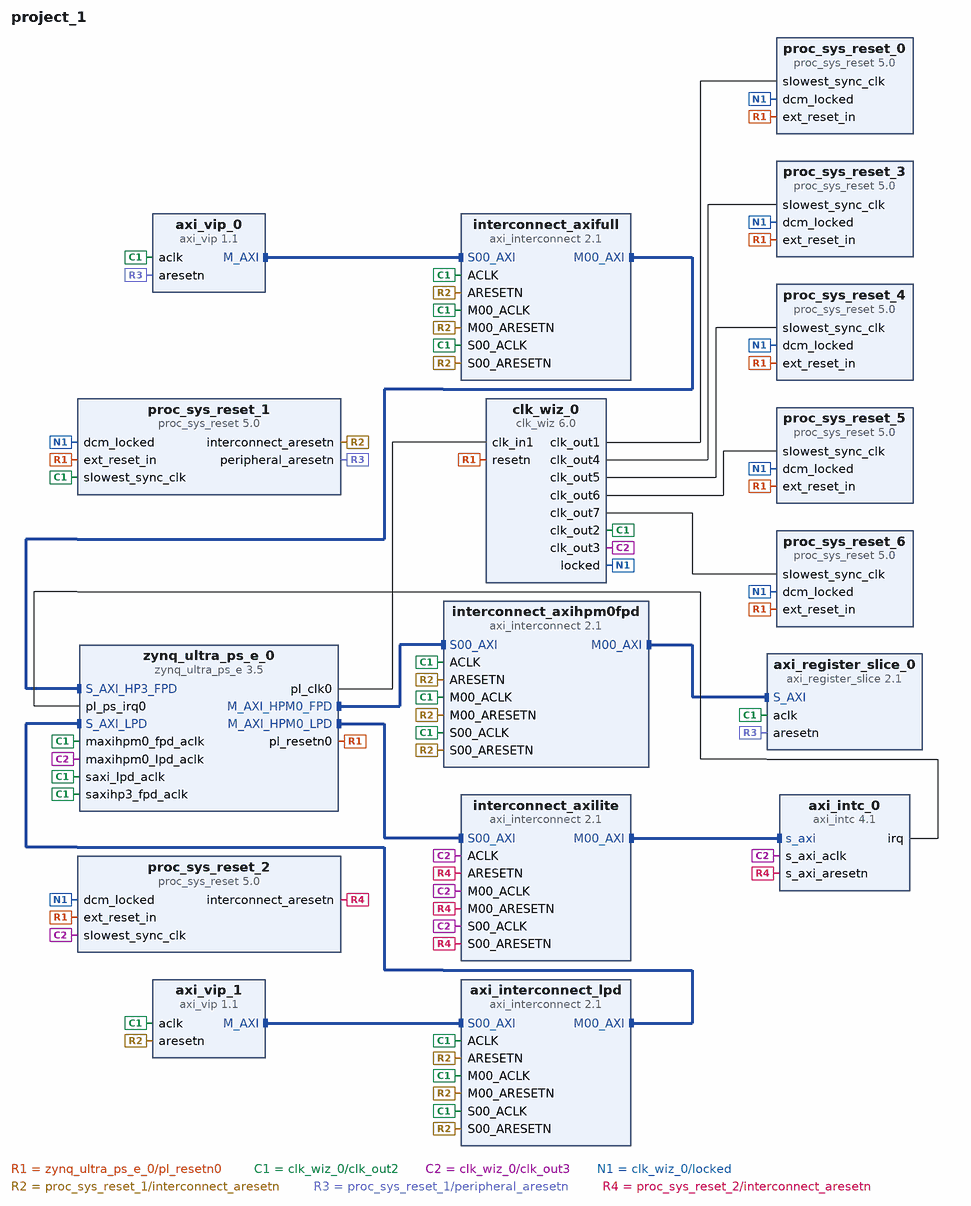
[diagram p0: block diagram of the top level]
# Vivado block design project_1, xczu9eg-ffvb1156-2-e, Vivado 2024.2
create_bd_design project_1

create_bd_cell -type ip -vlnv xilinx.com:ip:zynq_ultra_ps_e:3.5 zynq_ultra_ps_e_0
set_property -dict [list \
  CONFIG.PSU_BANK_0_IO_STANDARD LVCMOS18 \
  CONFIG.PSU_BANK_1_IO_STANDARD LVCMOS18 \
  CONFIG.PSU_BANK_2_IO_STANDARD LVCMOS18 \
  CONFIG.PSU_BANK_3_IO_STANDARD LVCMOS33 \
  CONFIG.PSU_DYNAMIC_DDR_CONFIG_EN 1 \
  CONFIG.PSU_USB3__DUAL_CLOCK_ENABLE 1 \
  CONFIG.PSU__CAN1__PERIPHERAL__ENABLE 1 \
  CONFIG.PSU__CAN1__PERIPHERAL__IO {MIO 24 .. 25} \
  CONFIG.PSU__CRF_APB__ACPU_CTRL__FREQMHZ 1200 \
  CONFIG.PSU__CRF_APB__ACPU_CTRL__SRCSEL APLL \
  CONFIG.PSU__CRF_APB__APLL_CTRL__SRCSEL PSS_REF_CLK \
  CONFIG.PSU__CRF_APB__DBG_FPD_CTRL__FREQMHZ 250 \
  CONFIG.PSU__CRF_APB__DBG_FPD_CTRL__SRCSEL IOPLL \
  CONFIG.PSU__CRF_APB__DBG_TRACE_CTRL__FREQMHZ 250 \
  CONFIG.PSU__CRF_APB__DBG_TRACE_CTRL__SRCSEL IOPLL \
  CONFIG.PSU__CRF_APB__DBG_TSTMP_CTRL__FREQMHZ 250 \
  CONFIG.PSU__CRF_APB__DBG_TSTMP_CTRL__SRCSEL IOPLL \
  CONFIG.PSU__CRF_APB__DDR_CTRL__FREQMHZ 1067 \
  CONFIG.PSU__CRF_APB__DDR_CTRL__SRCSEL DPLL \
  CONFIG.PSU__CRF_APB__DPDMA_REF_CTRL__FREQMHZ 600 \
  CONFIG.PSU__CRF_APB__DPDMA_REF_CTRL__SRCSEL APLL \
  CONFIG.PSU__CRF_APB__DPLL_CTRL__SRCSEL PSS_REF_CLK \
  CONFIG.PSU__CRF_APB__DP_AUDIO_REF_CTRL__SRCSEL RPLL \
  CONFIG.PSU__CRF_APB__DP_STC_REF_CTRL__SRCSEL RPLL \
  CONFIG.PSU__CRF_APB__DP_VIDEO_REF_CTRL__SRCSEL VPLL \
  CONFIG.PSU__CRF_APB__GDMA_REF_CTRL__FREQMHZ 600 \
  CONFIG.PSU__CRF_APB__GDMA_REF_CTRL__SRCSEL APLL \
  CONFIG.PSU__CRF_APB__GPU_REF_CTRL__FREQMHZ 500 \
  CONFIG.PSU__CRF_APB__GPU_REF_CTRL__SRCSEL IOPLL \
  CONFIG.PSU__CRF_APB__TOPSW_LSBUS_CTRL__FREQMHZ 100 \
  CONFIG.PSU__CRF_APB__TOPSW_LSBUS_CTRL__SRCSEL IOPLL \
  CONFIG.PSU__CRF_APB__TOPSW_MAIN_CTRL__FREQMHZ 533.33 \
  CONFIG.PSU__CRF_APB__TOPSW_MAIN_CTRL__SRCSEL DPLL \
  CONFIG.PSU__CRF_APB__VPLL_CTRL__SRCSEL PSS_REF_CLK \
  CONFIG.PSU__CRL_APB__ADMA_REF_CTRL__FREQMHZ 500 \
  CONFIG.PSU__CRL_APB__ADMA_REF_CTRL__SRCSEL IOPLL \
  CONFIG.PSU__CRL_APB__CAN1_REF_CTRL__FREQMHZ 100 \
  CONFIG.PSU__CRL_APB__CAN1_REF_CTRL__SRCSEL IOPLL \
  CONFIG.PSU__CRL_APB__CPU_R5_CTRL__FREQMHZ 500 \
  CONFIG.PSU__CRL_APB__CPU_R5_CTRL__SRCSEL IOPLL \
  CONFIG.PSU__CRL_APB__CSU_PLL_CTRL__FREQMHZ 400 \
  CONFIG.PSU__CRL_APB__CSU_PLL_CTRL__SRCSEL IOPLL \
  CONFIG.PSU__CRL_APB__DBG_LPD_CTRL__FREQMHZ 250 \
  CONFIG.PSU__CRL_APB__DBG_LPD_CTRL__SRCSEL IOPLL \
  CONFIG.PSU__CRL_APB__GEM3_REF_CTRL__FREQMHZ 125 \
  CONFIG.PSU__CRL_APB__GEM3_REF_CTRL__SRCSEL IOPLL \
  CONFIG.PSU__CRL_APB__I2C0_REF_CTRL__FREQMHZ 100 \
  CONFIG.PSU__CRL_APB__I2C0_REF_CTRL__SRCSEL IOPLL \
  CONFIG.PSU__CRL_APB__I2C1_REF_CTRL__FREQMHZ 100 \
  CONFIG.PSU__CRL_APB__I2C1_REF_CTRL__SRCSEL IOPLL \
  CONFIG.PSU__CRL_APB__IOPLL_CTRL__DIV2 0 \
  CONFIG.PSU__CRL_APB__IOPLL_CTRL__SRCSEL PSS_REF_CLK \
  CONFIG.PSU__CRL_APB__IOU_SWITCH_CTRL__FREQMHZ 250 \
  CONFIG.PSU__CRL_APB__IOU_SWITCH_CTRL__SRCSEL IOPLL \
  CONFIG.PSU__CRL_APB__LPD_LSBUS_CTRL__FREQMHZ 100 \
  CONFIG.PSU__CRL_APB__LPD_LSBUS_CTRL__SRCSEL IOPLL \
  CONFIG.PSU__CRL_APB__LPD_SWITCH_CTRL__FREQMHZ 500 \
  CONFIG.PSU__CRL_APB__LPD_SWITCH_CTRL__SRCSEL IOPLL \
  CONFIG.PSU__CRL_APB__PCAP_CTRL__FREQMHZ 200 \
  CONFIG.PSU__CRL_APB__PCAP_CTRL__SRCSEL IOPLL \
  CONFIG.PSU__CRL_APB__PL0_REF_CTRL__FREQMHZ 100 \
  CONFIG.PSU__CRL_APB__PL0_REF_CTRL__SRCSEL IOPLL \
  CONFIG.PSU__CRL_APB__PL1_REF_CTRL__SRCSEL IOPLL \
  CONFIG.PSU__CRL_APB__PL2_REF_CTRL__SRCSEL IOPLL \
  CONFIG.PSU__CRL_APB__PL3_REF_CTRL__SRCSEL IOPLL \
  CONFIG.PSU__CRL_APB__QSPI_REF_CTRL__FREQMHZ 125 \
  CONFIG.PSU__CRL_APB__QSPI_REF_CTRL__SRCSEL IOPLL \
  CONFIG.PSU__CRL_APB__RPLL_CTRL__SRCSEL PSS_REF_CLK \
  CONFIG.PSU__CRL_APB__SDIO0_REF_CTRL__SRCSEL IOPLL \
  CONFIG.PSU__CRL_APB__SDIO1_REF_CTRL__FREQMHZ 200 \
  CONFIG.PSU__CRL_APB__SDIO1_REF_CTRL__SRCSEL IOPLL \
  CONFIG.PSU__CRL_APB__SPI0_REF_CTRL__SRCSEL IOPLL \
  CONFIG.PSU__CRL_APB__SPI1_REF_CTRL__SRCSEL IOPLL \
  CONFIG.PSU__CRL_APB__TIMESTAMP_REF_CTRL__FREQMHZ 100 \
  CONFIG.PSU__CRL_APB__TIMESTAMP_REF_CTRL__SRCSEL IOPLL \
  CONFIG.PSU__CRL_APB__UART0_REF_CTRL__FREQMHZ 100 \
  CONFIG.PSU__CRL_APB__UART0_REF_CTRL__SRCSEL IOPLL \
  CONFIG.PSU__CRL_APB__UART1_REF_CTRL__FREQMHZ 100 \
  CONFIG.PSU__CRL_APB__UART1_REF_CTRL__SRCSEL IOPLL \
  CONFIG.PSU__CRL_APB__USB0_BUS_REF_CTRL__FREQMHZ 250 \
  CONFIG.PSU__CRL_APB__USB0_BUS_REF_CTRL__SRCSEL IOPLL \
  CONFIG.PSU__CRL_APB__USB3_DUAL_REF_CTRL__FREQMHZ 20 \
  CONFIG.PSU__CRL_APB__USB3_DUAL_REF_CTRL__SRCSEL IOPLL \
  CONFIG.PSU__CRL_APB__USB3__ENABLE 1 \
  CONFIG.PSU__CSUPMU__PERIPHERAL__VALID 1 \
  CONFIG.PSU__DDRC__BUS_WIDTH {64 Bit} \
  CONFIG.PSU__DDRC__COMPONENTS UDIMM \
  CONFIG.PSU__DDRC__DEVICE_CAPACITY {4096 MBits} \
  CONFIG.PSU__DDRC__DRAM_WIDTH {8 Bits} \
  CONFIG.PSU__DDRC__ECC Disabled \
  CONFIG.PSU__DDRC__FREQ_MHZ 1066.5 \
  CONFIG.PSU__DDRC__MEMORY_TYPE {DDR 4} \
  CONFIG.PSU__DDRC__SPEED_BIN DDR4_2133P \
  CONFIG.PSU__DDR_HIGH_ADDRESS_GUI_ENABLE 1 \
  CONFIG.PSU__DDR__INTERFACE__FREQMHZ 533.500 \
  CONFIG.PSU__DISPLAYPORT__LANE0__ENABLE 1 \
  CONFIG.PSU__DISPLAYPORT__LANE0__IO {GT Lane1} \
  CONFIG.PSU__DISPLAYPORT__LANE1__ENABLE 0 \
  CONFIG.PSU__DISPLAYPORT__PERIPHERAL__ENABLE 1 \
  CONFIG.PSU__DLL__ISUSED 1 \
  CONFIG.PSU__DPAUX__PERIPHERAL__ENABLE 1 \
  CONFIG.PSU__DPAUX__PERIPHERAL__IO {MIO 27 .. 30} \
  CONFIG.PSU__DP__LANE_SEL {Single Lower} \
  CONFIG.PSU__DP__REF_CLK_FREQ 27 \
  CONFIG.PSU__DP__REF_CLK_SEL {Ref Clk3} \
  CONFIG.PSU__ENET3__FIFO__ENABLE 0 \
  CONFIG.PSU__ENET3__GRP_MDIO__ENABLE 1 \
  CONFIG.PSU__ENET3__GRP_MDIO__IO {MIO 76 .. 77} \
  CONFIG.PSU__ENET3__PERIPHERAL__ENABLE 1 \
  CONFIG.PSU__ENET3__PERIPHERAL__IO {MIO 64 .. 75} \
  CONFIG.PSU__ENET3__PTP__ENABLE 0 \
  CONFIG.PSU__ENET3__TSU__ENABLE 0 \
  CONFIG.PSU__FPGA_PL0_ENABLE 1 \
  CONFIG.PSU__FPGA_PL1_ENABLE 1 \
  CONFIG.PSU__FPGA_PL2_ENABLE 1 \
  CONFIG.PSU__FPGA_PL3_ENABLE 1 \
  CONFIG.PSU__GEM3_COHERENCY 0 \
  CONFIG.PSU__GEM3_ROUTE_THROUGH_FPD 0 \
  CONFIG.PSU__GEM__TSU__ENABLE 0 \
  CONFIG.PSU__GEN_IPI_7__MASTER APU \
  CONFIG.PSU__GEN_IPI_8__MASTER APU \
  CONFIG.PSU__GPIO0_MIO__IO {MIO 0 .. 25} \
  CONFIG.PSU__GPIO0_MIO__PERIPHERAL__ENABLE 1 \
  CONFIG.PSU__GPIO1_MIO__IO {MIO 26 .. 51} \
  CONFIG.PSU__GPIO1_MIO__PERIPHERAL__ENABLE 1 \
  CONFIG.PSU__GPIO_EMIO__WIDTH {[91:0]} \
  CONFIG.PSU__GT__LINK_SPEED HBR \
  CONFIG.PSU__GT__PRE_EMPH_LVL_4 0 \
  CONFIG.PSU__GT__VLT_SWNG_LVL_4 0 \
  CONFIG.PSU__I2C0__PERIPHERAL__ENABLE 1 \
  CONFIG.PSU__I2C0__PERIPHERAL__IO {MIO 14 .. 15} \
  CONFIG.PSU__I2C1__PERIPHERAL__ENABLE 1 \
  CONFIG.PSU__I2C1__PERIPHERAL__IO {MIO 16 .. 17} \
  CONFIG.PSU__IOU_SLCR__IOU_TTC_APB_CLK__TTC0_SEL APB \
  CONFIG.PSU__IOU_SLCR__IOU_TTC_APB_CLK__TTC1_SEL APB \
  CONFIG.PSU__IOU_SLCR__IOU_TTC_APB_CLK__TTC2_SEL APB \
  CONFIG.PSU__IOU_SLCR__IOU_TTC_APB_CLK__TTC3_SEL APB \
  CONFIG.PSU__MAXIGP0__DATA_WIDTH 128 \
  CONFIG.PSU__NUM_FABRIC_RESETS 4 \
  CONFIG.PSU__OVERRIDE__BASIC_CLOCK 1 \
  CONFIG.PSU__PCIE__BAR0_VAL 0x0 \
  CONFIG.PSU__PCIE__BAR1_VAL 0x0 \
  CONFIG.PSU__PCIE__BAR2_VAL 0x0 \
  CONFIG.PSU__PCIE__BAR3_VAL 0x0 \
  CONFIG.PSU__PCIE__BAR4_VAL 0x0 \
  CONFIG.PSU__PCIE__BAR5_VAL 0x0 \
  CONFIG.PSU__PCIE__CLASS_CODE_BASE 0x06 \
  CONFIG.PSU__PCIE__CLASS_CODE_INTERFACE 0x0 \
  CONFIG.PSU__PCIE__CLASS_CODE_SUB 0x4 \
  CONFIG.PSU__PCIE__CLASS_CODE_VALUE 0x60400 \
  CONFIG.PSU__PCIE__CRS_SW_VISIBILITY 1 \
  CONFIG.PSU__PCIE__DEVICE_ID 0xD021 \
  CONFIG.PSU__PCIE__DEVICE_PORT_TYPE {Root Port} \
  CONFIG.PSU__PCIE__EROM_VAL 0x0 \
  CONFIG.PSU__PCIE__LANE0__ENABLE 1 \
  CONFIG.PSU__PCIE__LANE0__IO {GT Lane0} \
  CONFIG.PSU__PCIE__LINK_SPEED {5.0 Gb/s} \
  CONFIG.PSU__PCIE__MAXIMUM_LINK_WIDTH x1 \
  CONFIG.PSU__PCIE__MAX_PAYLOAD_SIZE {256 bytes} \
  CONFIG.PSU__PCIE__PERIPHERAL__ENABLE 1 \
  CONFIG.PSU__PCIE__PERIPHERAL__ENDPOINT_ENABLE 0 \
  CONFIG.PSU__PCIE__PERIPHERAL__ROOTPORT_ENABLE 1 \
  CONFIG.PSU__PCIE__PERIPHERAL__ROOTPORT_IO {MIO 31} \
  CONFIG.PSU__PCIE__REF_CLK_FREQ 100 \
  CONFIG.PSU__PCIE__REF_CLK_SEL {Ref Clk0} \
  CONFIG.PSU__PCIE__REVISION_ID 0x0 \
  CONFIG.PSU__PCIE__SUBSYSTEM_ID 0x7 \
  CONFIG.PSU__PCIE__SUBSYSTEM_VENDOR_ID 0x10EE \
  CONFIG.PSU__PCIE__VENDOR_ID 0x10EE \
  CONFIG.PSU__PMU_COHERENCY 0 \
  CONFIG.PSU__PMU__AIBACK__ENABLE 0 \
  CONFIG.PSU__PMU__EMIO_GPI__ENABLE 0 \
  CONFIG.PSU__PMU__EMIO_GPO__ENABLE 0 \
  CONFIG.PSU__PMU__GPI0__ENABLE 0 \
  CONFIG.PSU__PMU__GPI1__ENABLE 0 \
  CONFIG.PSU__PMU__GPI2__ENABLE 0 \
  CONFIG.PSU__PMU__GPI3__ENABLE 0 \
  CONFIG.PSU__PMU__GPI4__ENABLE 0 \
  CONFIG.PSU__PMU__GPI5__ENABLE 0 \
  CONFIG.PSU__PMU__GPO0__ENABLE 1 \
  CONFIG.PSU__PMU__GPO0__IO {MIO 32} \
  CONFIG.PSU__PMU__GPO1__ENABLE 1 \
  CONFIG.PSU__PMU__GPO1__IO {MIO 33} \
  CONFIG.PSU__PMU__GPO2__ENABLE 1 \
  CONFIG.PSU__PMU__GPO2__IO {MIO 34} \
  CONFIG.PSU__PMU__GPO2__POLARITY high \
  CONFIG.PSU__PMU__GPO3__ENABLE 1 \
  CONFIG.PSU__PMU__GPO3__IO {MIO 35} \
  CONFIG.PSU__PMU__GPO3__POLARITY low \
  CONFIG.PSU__PMU__GPO4__ENABLE 1 \
  CONFIG.PSU__PMU__GPO4__IO {MIO 36} \
  CONFIG.PSU__PMU__GPO4__POLARITY low \
  CONFIG.PSU__PMU__GPO5__ENABLE 1 \
  CONFIG.PSU__PMU__GPO5__IO {MIO 37} \
  CONFIG.PSU__PMU__GPO5__POLARITY low \
  CONFIG.PSU__PMU__PERIPHERAL__ENABLE 1 \
  CONFIG.PSU__PMU__PLERROR__ENABLE 0 \
  CONFIG.PSU__PRESET_APPLIED 1 \
  CONFIG.PSU__PSS_REF_CLK__FREQMHZ 33.330 \
  CONFIG.PSU__QSPI_COHERENCY 0 \
  CONFIG.PSU__QSPI_ROUTE_THROUGH_FPD 0 \
  CONFIG.PSU__QSPI__GRP_FBCLK__ENABLE 1 \
  CONFIG.PSU__QSPI__GRP_FBCLK__IO {MIO 6} \
  CONFIG.PSU__QSPI__PERIPHERAL__DATA_MODE x4 \
  CONFIG.PSU__QSPI__PERIPHERAL__ENABLE 1 \
  CONFIG.PSU__QSPI__PERIPHERAL__IO {MIO 0 .. 12} \
  CONFIG.PSU__QSPI__PERIPHERAL__MODE {Dual Parallel} \
  CONFIG.PSU__SATA__LANE1__IO {GT Lane3} \
  CONFIG.PSU__SATA__PERIPHERAL__ENABLE 1 \
  CONFIG.PSU__SATA__REF_CLK_FREQ 125 \
  CONFIG.PSU__SATA__REF_CLK_SEL {Ref Clk1} \
  CONFIG.PSU__SD1_COHERENCY 0 \
  CONFIG.PSU__SD1_ROUTE_THROUGH_FPD 0 \
  CONFIG.PSU__SD1__CLK_100_SDR_OTAP_DLY 0x3 \
  CONFIG.PSU__SD1__CLK_200_SDR_OTAP_DLY 0x3 \
  CONFIG.PSU__SD1__CLK_50_DDR_ITAP_DLY 0x3D \
  CONFIG.PSU__SD1__CLK_50_DDR_OTAP_DLY 0x4 \
  CONFIG.PSU__SD1__CLK_50_SDR_ITAP_DLY 0x15 \
  CONFIG.PSU__SD1__CLK_50_SDR_OTAP_DLY 0x5 \
  CONFIG.PSU__SD1__DATA_TRANSFER_MODE 8Bit \
  CONFIG.PSU__SD1__GRP_CD__ENABLE 1 \
  CONFIG.PSU__SD1__GRP_CD__IO {MIO 45} \
  CONFIG.PSU__SD1__GRP_POW__ENABLE 1 \
  CONFIG.PSU__SD1__GRP_POW__IO {MIO 43} \
  CONFIG.PSU__SD1__GRP_WP__ENABLE 1 \
  CONFIG.PSU__SD1__GRP_WP__IO {MIO 44} \
  CONFIG.PSU__SD1__PERIPHERAL__ENABLE 1 \
  CONFIG.PSU__SD1__PERIPHERAL__IO {MIO 39 .. 51} \
  CONFIG.PSU__SD1__SLOT_TYPE {SD 3.0} \
  CONFIG.PSU__SWDT0__CLOCK__ENABLE 0 \
  CONFIG.PSU__SWDT0__PERIPHERAL__ENABLE 1 \
  CONFIG.PSU__SWDT0__RESET__ENABLE 0 \
  CONFIG.PSU__SWDT1__CLOCK__ENABLE 0 \
  CONFIG.PSU__SWDT1__PERIPHERAL__ENABLE 1 \
  CONFIG.PSU__SWDT1__RESET__ENABLE 0 \
  CONFIG.PSU__TSU__BUFG_PORT_PAIR 0 \
  CONFIG.PSU__TTC0__CLOCK__ENABLE 0 \
  CONFIG.PSU__TTC0__PERIPHERAL__ENABLE 1 \
  CONFIG.PSU__TTC0__PERIPHERAL__IO EMIO \
  CONFIG.PSU__TTC0__WAVEOUT__ENABLE 0 \
  CONFIG.PSU__TTC1__CLOCK__ENABLE 0 \
  CONFIG.PSU__TTC1__PERIPHERAL__ENABLE 1 \
  CONFIG.PSU__TTC1__PERIPHERAL__IO EMIO \
  CONFIG.PSU__TTC1__WAVEOUT__ENABLE 0 \
  CONFIG.PSU__TTC2__CLOCK__ENABLE 0 \
  CONFIG.PSU__TTC2__PERIPHERAL__ENABLE 1 \
  CONFIG.PSU__TTC2__PERIPHERAL__IO EMIO \
  CONFIG.PSU__TTC2__WAVEOUT__ENABLE 0 \
  CONFIG.PSU__TTC3__CLOCK__ENABLE 0 \
  CONFIG.PSU__TTC3__PERIPHERAL__ENABLE 1 \
  CONFIG.PSU__TTC3__PERIPHERAL__IO EMIO \
  CONFIG.PSU__TTC3__WAVEOUT__ENABLE 0 \
  CONFIG.PSU__UART0__BAUD_RATE 115200 \
  CONFIG.PSU__UART0__MODEM__ENABLE 0 \
  CONFIG.PSU__UART0__PERIPHERAL__ENABLE 1 \
  CONFIG.PSU__UART0__PERIPHERAL__IO {MIO 18 .. 19} \
  CONFIG.PSU__UART1__BAUD_RATE 115200 \
  CONFIG.PSU__UART1__MODEM__ENABLE 0 \
  CONFIG.PSU__UART1__PERIPHERAL__ENABLE 1 \
  CONFIG.PSU__UART1__PERIPHERAL__IO {MIO 20 .. 21} \
  CONFIG.PSU__USB0_COHERENCY 0 \
  CONFIG.PSU__USB0__PERIPHERAL__ENABLE 1 \
  CONFIG.PSU__USB0__PERIPHERAL__IO {MIO 52 .. 63} \
  CONFIG.PSU__USB0__REF_CLK_FREQ 26 \
  CONFIG.PSU__USB0__REF_CLK_SEL {Ref Clk2} \
  CONFIG.PSU__USB2_0__EMIO__ENABLE 0 \
  CONFIG.PSU__USB3_0__EMIO__ENABLE 0 \
  CONFIG.PSU__USB3_0__PERIPHERAL__ENABLE 1 \
  CONFIG.PSU__USB3_0__PERIPHERAL__IO {GT Lane2} \
  CONFIG.PSU__USB__RESET__MODE {Boot Pin} \
  CONFIG.PSU__USB__RESET__POLARITY {Active Low} \
  CONFIG.PSU__USE__IRQ0 1 \
  CONFIG.PSU__USE__M_AXI_GP0 1 \
  CONFIG.PSU__USE__M_AXI_GP1 0 \
  CONFIG.PSU__USE__M_AXI_GP2 1 \
  CONFIG.PSU__USE__S_AXI_GP5 1 \
  CONFIG.PSU__USE__S_AXI_GP6 1 \
] [get_bd_cells zynq_ultra_ps_e_0]
# 225 more settings of zynq_ultra_ps_e_0 are not shown: defaults, MIO pin electricals, DDR timing, and values the tool derives
create_bd_cell -type ip -vlnv xilinx.com:ip:axi_intc:4.1 axi_intc_0
set_property -dict {CONFIG.C_ASYNC_INTR 0xFFFFFFFF CONFIG.C_IRQ_CONNECTION 1 CONFIG.C_IRQ_IS_LEVEL 1} [get_bd_cells axi_intc_0]
create_bd_cell -type ip -vlnv xilinx.com:ip:axi_interconnect:2.1 axi_interconnect_lpd
set_property -dict {CONFIG.NUM_MI 1} [get_bd_cells axi_interconnect_lpd]
create_bd_cell -type ip -vlnv xilinx.com:ip:axi_register_slice:2.1 axi_register_slice_0
set_property -dict {CONFIG.DATA_WIDTH 128} [get_bd_cells axi_register_slice_0]
create_bd_cell -type ip -vlnv xilinx.com:ip:axi_vip:1.1 axi_vip_0
set_property -dict [list \
  CONFIG.ADDR_WIDTH 32 \
  CONFIG.ARUSER_WIDTH 0 \
  CONFIG.AWUSER_WIDTH 0 \
  CONFIG.BUSER_WIDTH 0 \
  CONFIG.DATA_WIDTH 32 \
  CONFIG.HAS_BRESP 1 \
  CONFIG.HAS_BURST 1 \
  CONFIG.HAS_CACHE 1 \
  CONFIG.HAS_LOCK 1 \
  CONFIG.HAS_PROT 1 \
  CONFIG.HAS_QOS 1 \
  CONFIG.HAS_REGION 1 \
  CONFIG.HAS_RRESP 1 \
  CONFIG.HAS_WSTRB 1 \
  CONFIG.ID_WIDTH 0 \
  CONFIG.INTERFACE_MODE MASTER \
  CONFIG.PROTOCOL AXI4 \
  CONFIG.READ_WRITE_MODE READ_WRITE \
  CONFIG.RUSER_WIDTH 0 \
  CONFIG.SUPPORTS_NARROW 1 \
  CONFIG.WUSER_WIDTH 0 \
] [get_bd_cells axi_vip_0]
create_bd_cell -type ip -vlnv xilinx.com:ip:axi_vip:1.1 axi_vip_1
set_property -dict [list \
  CONFIG.ADDR_WIDTH 32 \
  CONFIG.ARUSER_WIDTH 0 \
  CONFIG.AWUSER_WIDTH 0 \
  CONFIG.BUSER_WIDTH 0 \
  CONFIG.DATA_WIDTH 32 \
  CONFIG.HAS_BRESP 1 \
  CONFIG.HAS_BURST 1 \
  CONFIG.HAS_CACHE 1 \
  CONFIG.HAS_LOCK 1 \
  CONFIG.HAS_PROT 1 \
  CONFIG.HAS_QOS 1 \
  CONFIG.HAS_REGION 1 \
  CONFIG.HAS_RRESP 1 \
  CONFIG.HAS_WSTRB 1 \
  CONFIG.ID_WIDTH 0 \
  CONFIG.INTERFACE_MODE MASTER \
  CONFIG.PROTOCOL AXI4 \
  CONFIG.READ_WRITE_MODE READ_WRITE \
  CONFIG.RUSER_WIDTH 0 \
  CONFIG.SUPPORTS_NARROW 1 \
  CONFIG.WUSER_WIDTH 0 \
] [get_bd_cells axi_vip_1]
create_bd_cell -type ip -vlnv xilinx.com:ip:clk_wiz:6.0 clk_wiz_0
set_property -dict [list \
  CONFIG.CLKIN1_JITTER_PS 100.01 \
  CONFIG.CLKOUT1_JITTER 107.579 \
  CONFIG.CLKOUT1_PHASE_ERROR 87.187 \
  CONFIG.CLKOUT1_REQUESTED_OUT_FREQ 150 \
  CONFIG.CLKOUT2_JITTER 94.872 \
  CONFIG.CLKOUT2_PHASE_ERROR 87.187 \
  CONFIG.CLKOUT2_REQUESTED_OUT_FREQ 300 \
  CONFIG.CLKOUT2_USED true \
  CONFIG.CLKOUT3_JITTER 122.171 \
  CONFIG.CLKOUT3_PHASE_ERROR 87.187 \
  CONFIG.CLKOUT3_REQUESTED_OUT_FREQ 75 \
  CONFIG.CLKOUT3_USED true \
  CONFIG.CLKOUT4_JITTER 115.843 \
  CONFIG.CLKOUT4_PHASE_ERROR 87.187 \
  CONFIG.CLKOUT4_REQUESTED_OUT_FREQ 100.000 \
  CONFIG.CLKOUT4_USED true \
  CONFIG.CLKOUT5_JITTER 102.096 \
  CONFIG.CLKOUT5_PHASE_ERROR 87.187 \
  CONFIG.CLKOUT5_REQUESTED_OUT_FREQ 200.000 \
  CONFIG.CLKOUT5_USED true \
  CONFIG.CLKOUT6_JITTER 90.083 \
  CONFIG.CLKOUT6_PHASE_ERROR 87.187 \
  CONFIG.CLKOUT6_REQUESTED_OUT_FREQ 400.000 \
  CONFIG.CLKOUT6_USED true \
  CONFIG.CLKOUT7_JITTER 83.777 \
  CONFIG.CLKOUT7_PHASE_ERROR 87.187 \
  CONFIG.CLKOUT7_REQUESTED_OUT_FREQ 600.000 \
  CONFIG.CLKOUT7_USED true \
  CONFIG.MMCM_CLKFBOUT_MULT_F 12.000 \
  CONFIG.MMCM_CLKIN1_PERIOD 10.001 \
  CONFIG.MMCM_CLKOUT0_DIVIDE_F 8.000 \
  CONFIG.MMCM_CLKOUT1_DIVIDE 4 \
  CONFIG.MMCM_CLKOUT2_DIVIDE 16 \
  CONFIG.MMCM_CLKOUT3_DIVIDE 12 \
  CONFIG.MMCM_CLKOUT4_DIVIDE 6 \
  CONFIG.MMCM_CLKOUT5_DIVIDE 3 \
  CONFIG.MMCM_CLKOUT6_DIVIDE 2 \
  CONFIG.MMCM_DIVCLK_DIVIDE 1 \
  CONFIG.NUM_OUT_CLKS 7 \
  CONFIG.RESET_PORT resetn \
  CONFIG.RESET_TYPE ACTIVE_LOW \
] [get_bd_cells clk_wiz_0]
create_bd_cell -type ip -vlnv xilinx.com:ip:axi_interconnect:2.1 interconnect_axifull
set_property -dict {CONFIG.NUM_MI 1} [get_bd_cells interconnect_axifull]
create_bd_cell -type ip -vlnv xilinx.com:ip:axi_interconnect:2.1 interconnect_axihpm0fpd
set_property -dict {CONFIG.NUM_MI 1} [get_bd_cells interconnect_axihpm0fpd]
create_bd_cell -type ip -vlnv xilinx.com:ip:axi_interconnect:2.1 interconnect_axilite
set_property -dict {CONFIG.NUM_MI 1} [get_bd_cells interconnect_axilite]
create_bd_cell -type ip -vlnv xilinx.com:ip:proc_sys_reset:5.0 proc_sys_reset_0
create_bd_cell -type ip -vlnv xilinx.com:ip:proc_sys_reset:5.0 proc_sys_reset_1
create_bd_cell -type ip -vlnv xilinx.com:ip:proc_sys_reset:5.0 proc_sys_reset_2
create_bd_cell -type ip -vlnv xilinx.com:ip:proc_sys_reset:5.0 proc_sys_reset_3
create_bd_cell -type ip -vlnv xilinx.com:ip:proc_sys_reset:5.0 proc_sys_reset_4
create_bd_cell -type ip -vlnv xilinx.com:ip:proc_sys_reset:5.0 proc_sys_reset_5
create_bd_cell -type ip -vlnv xilinx.com:ip:proc_sys_reset:5.0 proc_sys_reset_6

# ---- connections ----

connect_bd_intf_net -intf_net axi_interconnect_0_M00_AXI [get_bd_intf_pins axi_intc_0/s_axi] [get_bd_intf_pins interconnect_axilite/M00_AXI]
connect_bd_intf_net -intf_net axi_interconnect_0_M00_AXI1 [get_bd_intf_pins axi_interconnect_lpd/M00_AXI] [get_bd_intf_pins zynq_ultra_ps_e_0/S_AXI_LPD]
connect_bd_intf_net -intf_net axi_interconnect_1_M00_AXI [get_bd_intf_pins interconnect_axifull/M00_AXI] [get_bd_intf_pins zynq_ultra_ps_e_0/S_AXI_HP3_FPD]
connect_bd_intf_net [get_bd_intf_pins axi_vip_0/M_AXI] [get_bd_intf_pins interconnect_axifull/S00_AXI]
connect_bd_intf_net [get_bd_intf_pins axi_interconnect_lpd/S00_AXI] [get_bd_intf_pins axi_vip_1/M_AXI]
connect_bd_intf_net [get_bd_intf_pins axi_register_slice_0/S_AXI] [get_bd_intf_pins interconnect_axihpm0fpd/M00_AXI]
connect_bd_intf_net [get_bd_intf_pins interconnect_axihpm0fpd/S00_AXI] [get_bd_intf_pins zynq_ultra_ps_e_0/M_AXI_HPM0_FPD]
connect_bd_intf_net [get_bd_intf_pins interconnect_axilite/S00_AXI] [get_bd_intf_pins zynq_ultra_ps_e_0/M_AXI_HPM0_LPD]
connect_bd_net [get_bd_pins zynq_ultra_ps_e_0/pl_resetn0] \
  [get_bd_pins clk_wiz_0/resetn] [get_bd_pins proc_sys_reset_0/ext_reset_in] [get_bd_pins proc_sys_reset_1/ext_reset_in] \
  [get_bd_pins proc_sys_reset_2/ext_reset_in] [get_bd_pins proc_sys_reset_3/ext_reset_in] \
  [get_bd_pins proc_sys_reset_4/ext_reset_in] [get_bd_pins proc_sys_reset_5/ext_reset_in] \
  [get_bd_pins proc_sys_reset_6/ext_reset_in]
connect_bd_net [get_bd_pins axi_intc_0/irq] [get_bd_pins zynq_ultra_ps_e_0/pl_ps_irq0]
connect_bd_net [get_bd_pins clk_wiz_0/clk_out2] \
  [get_bd_pins axi_interconnect_lpd/ACLK] [get_bd_pins axi_interconnect_lpd/M00_ACLK] \
  [get_bd_pins axi_interconnect_lpd/S00_ACLK] [get_bd_pins axi_register_slice_0/aclk] [get_bd_pins axi_vip_0/aclk] \
  [get_bd_pins axi_vip_1/aclk] [get_bd_pins interconnect_axifull/ACLK] [get_bd_pins interconnect_axifull/M00_ACLK] \
  [get_bd_pins interconnect_axifull/S00_ACLK] [get_bd_pins interconnect_axihpm0fpd/ACLK] \
  [get_bd_pins interconnect_axihpm0fpd/M00_ACLK] [get_bd_pins interconnect_axihpm0fpd/S00_ACLK] \
  [get_bd_pins proc_sys_reset_1/slowest_sync_clk] [get_bd_pins zynq_ultra_ps_e_0/maxihpm0_fpd_aclk] \
  [get_bd_pins zynq_ultra_ps_e_0/saxi_lpd_aclk] [get_bd_pins zynq_ultra_ps_e_0/saxihp3_fpd_aclk]
connect_bd_net [get_bd_pins clk_wiz_0/clk_out3] \
  [get_bd_pins axi_intc_0/s_axi_aclk] [get_bd_pins interconnect_axilite/ACLK] [get_bd_pins interconnect_axilite/M00_ACLK] \
  [get_bd_pins interconnect_axilite/S00_ACLK] [get_bd_pins proc_sys_reset_2/slowest_sync_clk] \
  [get_bd_pins zynq_ultra_ps_e_0/maxihpm0_lpd_aclk]
connect_bd_net [get_bd_pins clk_wiz_0/clk_out1] [get_bd_pins proc_sys_reset_0/slowest_sync_clk]
connect_bd_net [get_bd_pins clk_wiz_0/clk_out4] [get_bd_pins proc_sys_reset_3/slowest_sync_clk]
connect_bd_net [get_bd_pins clk_wiz_0/clk_out5] [get_bd_pins proc_sys_reset_4/slowest_sync_clk]
connect_bd_net [get_bd_pins clk_wiz_0/clk_out6] [get_bd_pins proc_sys_reset_5/slowest_sync_clk]
connect_bd_net [get_bd_pins clk_wiz_0/clk_out7] [get_bd_pins proc_sys_reset_6/slowest_sync_clk]
connect_bd_net [get_bd_pins clk_wiz_0/locked] \
  [get_bd_pins proc_sys_reset_0/dcm_locked] [get_bd_pins proc_sys_reset_1/dcm_locked] \
  [get_bd_pins proc_sys_reset_2/dcm_locked] [get_bd_pins proc_sys_reset_3/dcm_locked] \
  [get_bd_pins proc_sys_reset_4/dcm_locked] [get_bd_pins proc_sys_reset_5/dcm_locked] \
  [get_bd_pins proc_sys_reset_6/dcm_locked]
connect_bd_net [get_bd_pins proc_sys_reset_1/interconnect_aresetn] \
  [get_bd_pins axi_interconnect_lpd/ARESETN] [get_bd_pins axi_interconnect_lpd/M00_ARESETN] \
  [get_bd_pins axi_interconnect_lpd/S00_ARESETN] [get_bd_pins axi_vip_1/aresetn] [get_bd_pins interconnect_axifull/ARESETN] \
  [get_bd_pins interconnect_axifull/M00_ARESETN] [get_bd_pins interconnect_axifull/S00_ARESETN] \
  [get_bd_pins interconnect_axihpm0fpd/ARESETN] [get_bd_pins interconnect_axihpm0fpd/M00_ARESETN] \
  [get_bd_pins interconnect_axihpm0fpd/S00_ARESETN]
connect_bd_net [get_bd_pins proc_sys_reset_1/peripheral_aresetn] [get_bd_pins axi_register_slice_0/aresetn] [get_bd_pins axi_vip_0/aresetn]
connect_bd_net [get_bd_pins proc_sys_reset_2/interconnect_aresetn] \
  [get_bd_pins axi_intc_0/s_axi_aresetn] [get_bd_pins interconnect_axilite/ARESETN] \
  [get_bd_pins interconnect_axilite/M00_ARESETN] [get_bd_pins interconnect_axilite/S00_ARESETN]
connect_bd_net [get_bd_pins zynq_ultra_ps_e_0/pl_clk0] [get_bd_pins clk_wiz_0/clk_in1]
set_property PFM.AXI_PORT {M_AXI_HPM1_FPD {memport "M_AXI_GP"} S_AXI_HPC0_FPD {memport "S_AXI_HPC" sptag "HPC0" memory "${::PS_INST} HPC0_DDR_LOW"}  S_AXI_HPC1_FPD {memport "S_AXI_HPC" sptag "HPC1" memory "${::PS_INST} HPC1_DDR_LOW"}  S_AXI_HP0_FPD {memport "S_AXI_HP" sptag "HP0" memory "${::PS_INST} HP0_DDR_LOW"}  S_AXI_HP1_FPD {memport "S_AXI_HP" sptag "HP1" memory "${::PS_INST} HP1_DDR_LOW"}  S_AXI_HP2_FPD {memport "S_AXI_HP" sptag "HP2" memory "${::PS_INST} HP2_DDR_LOW"}} [get_bd_cells zynq_ultra_ps_e_0]
set_property PFM.IRQ {intr {id 0 range 32}} [get_bd_cells axi_intc_0]
set_property PFM.AXI_PORT {S01_AXI {memport "S_AXI_HP" sptag "LPD" memory "${::PS_INST} LPD_DDR_LOW"} S02_AXI {memport "S_AXI_HP" sptag "LPD" memory "${::PS_INST} LPD_DDR_LOW"} S03_AXI {memport "S_AXI_HP" sptag "LPD" memory "${::PS_INST} LPD_DDR_LOW"} S04_AXI {memport "S_AXI_HP" sptag "LPD" memory "${::PS_INST} LPD_DDR_LOW"} S05_AXI {memport "S_AXI_HP" sptag "LPD" memory "${::PS_INST} LPD_DDR_LOW"} S06_AXI {memport "S_AXI_HP" sptag "LPD" memory "${::PS_INST} LPD_DDR_LOW"} S07_AXI {memport "S_AXI_HP" sptag "LPD" memory "${::PS_INST} LPD_DDR_LOW"} S08_AXI {memport "S_AXI_HP" sptag "LPD" memory "${::PS_INST} LPD_DDR_LOW"} S09_AXI {memport "S_AXI_HP" sptag "LPD" memory "${::PS_INST} LPD_DDR_LOW"} S10_AXI {memport "S_AXI_HP" sptag "LPD" memory "${::PS_INST} LPD_DDR_LOW"} S11_AXI {memport "S_AXI_HP" sptag "LPD" memory "${::PS_INST} LPD_DDR_LOW"} S12_AXI {memport "S_AXI_HP" sptag "LPD" memory "${::PS_INST} LPD_DDR_LOW"} S13_AXI {memport "S_AXI_HP" sptag "LPD" memory "${::PS_INST} LPD_DDR_LOW"} S14_AXI {memport "S_AXI_HP" sptag "LPD" memory "${::PS_INST} LPD_DDR_LOW"} S15_AXI {memport "S_AXI_HP" sptag "LPD" memory "${::PS_INST} LPD_DDR_LOW"}} [get_bd_cells axi_interconnect_lpd]
set_property PFM.CLOCK {clk_out1 {id "0" is_default "true" proc_sys_reset "proc_sys_reset_0" status "fixed"} clk_out2 {id "1" is_default "false" proc_sys_reset "proc_sys_reset_1" status "fixed"} clk_out3 {id "2" is_default "false" proc_sys_reset "/proc_sys_reset_2" status "fixed"} clk_out4 {id "3" is_default "false" proc_sys_reset "/proc_sys_reset_3" status "fixed"} clk_out5 {id "4" is_default "false" proc_sys_reset "/proc_sys_reset_4" status "fixed"} clk_out6 {id "5" is_default "false" proc_sys_reset "/proc_sys_reset_5" status "fixed"} clk_out7 {id "6" is_default "false" proc_sys_reset "/proc_sys_reset_6" status "fixed"}} [get_bd_cells clk_wiz_0]
set_property HDL_ATTRIBUTE.DPA_TRACE_SLAVE true [get_bd_cells interconnect_axifull]
set_property PFM.AXI_PORT {S01_AXI {memport "S_AXI_HP" sptag "HP3" memory "${::PS_INST} HP3_DDR_LOW"} S02_AXI {memport "S_AXI_HP" sptag "HP3" memory "${::PS_INST} HP3_DDR_LOW"} S03_AXI {memport "S_AXI_HP" sptag "HP3" memory "${::PS_INST} HP3_DDR_LOW"} S04_AXI {memport "S_AXI_HP" sptag "HP3" memory "${::PS_INST} HP3_DDR_LOW"} S05_AXI {memport "S_AXI_HP" sptag "HP3" memory "${::PS_INST} HP3_DDR_LOW"} S06_AXI {memport "S_AXI_HP" sptag "HP3" memory "${::PS_INST} HP3_DDR_LOW"} S07_AXI {memport "S_AXI_HP" sptag "HP3" memory "${::PS_INST} HP3_DDR_LOW"} S08_AXI {memport "S_AXI_HP" sptag "HP3" memory "${::PS_INST} HP3_DDR_LOW"} S09_AXI {memport "S_AXI_HP" sptag "HP3" memory "${::PS_INST} HP3_DDR_LOW"} S10_AXI {memport "S_AXI_HP" sptag "HP3" memory "${::PS_INST} HP3_DDR_LOW"} S11_AXI {memport "S_AXI_HP" sptag "HP3" memory "${::PS_INST} HP3_DDR_LOW"} S12_AXI {memport "S_AXI_HP" sptag "HP3" memory "${::PS_INST} HP3_DDR_LOW"} S13_AXI {memport "S_AXI_HP" sptag "HP3" memory "${::PS_INST} HP3_DDR_LOW"} S14_AXI {memport "S_AXI_HP" sptag "HP3" memory "${::PS_INST} HP3_DDR_LOW"} S15_AXI {memport "S_AXI_HP" sptag "HP3" memory "${::PS_INST} HP3_DDR_LOW"}} [get_bd_cells interconnect_axifull]
set_property HDL_ATTRIBUTE.DPA_TRACE_MASTER true [get_bd_cells interconnect_axihpm0fpd]
set_property HDL_ATTRIBUTE.DPA_AXILITE_MASTER fallback [get_bd_cells interconnect_axilite]
set_property PFM.AXI_PORT {M01_AXI {memport "M_AXI_GP"} M02_AXI {memport "M_AXI_GP"} M03_AXI {memport "M_AXI_GP"} M04_AXI {memport "M_AXI_GP"} M05_AXI {memport "M_AXI_GP"} M06_AXI {memport "M_AXI_GP"} M07_AXI {memport "M_AXI_GP"} M08_AXI {memport "M_AXI_GP"} M09_AXI {memport "M_AXI_GP"} M10_AXI {memport "M_AXI_GP"} M11_AXI {memport "M_AXI_GP"} M12_AXI {memport "M_AXI_GP"} M13_AXI {memport "M_AXI_GP"} M14_AXI {memport "M_AXI_GP"} M15_AXI {memport "M_AXI_GP"} M16_AXI {memport "M_AXI_GP"} M17_AXI {memport "M_AXI_GP"} M18_AXI {memport "M_AXI_GP"} M19_AXI {memport "M_AXI_GP"} M20_AXI {memport "M_AXI_GP"} M21_AXI {memport "M_AXI_GP"} M22_AXI {memport "M_AXI_GP"} M23_AXI {memport "M_AXI_GP"} M24_AXI {memport "M_AXI_GP"} M25_AXI {memport "M_AXI_GP"} M26_AXI {memport "M_AXI_GP"} M27_AXI {memport "M_AXI_GP"} M28_AXI {memport "M_AXI_GP"} M29_AXI {memport "M_AXI_GP"} M30_AXI {memport "M_AXI_GP"} M31_AXI {memport "M_AXI_GP"} M32_AXI {memport "M_AXI_GP"} M33_AXI {memport "M_AXI_GP"} M34_AXI {memport "M_AXI_GP"} M35_AXI {memport "M_AXI_GP"} M36_AXI {memport "M_AXI_GP"} M37_AXI {memport "M_AXI_GP"} M38_AXI {memport "M_AXI_GP"} M39_AXI {memport "M_AXI_GP"} M40_AXI {memport "M_AXI_GP"} M41_AXI {memport "M_AXI_GP"} M42_AXI {memport "M_AXI_GP"} M43_AXI {memport "M_AXI_GP"} M44_AXI {memport "M_AXI_GP"} M45_AXI {memport "M_AXI_GP"} M46_AXI {memport "M_AXI_GP"} M47_AXI {memport "M_AXI_GP"} M48_AXI {memport "M_AXI_GP"} M49_AXI {memport "M_AXI_GP"} M50_AXI {memport "M_AXI_GP"} M51_AXI {memport "M_AXI_GP"} M52_AXI {memport "M_AXI_GP"} M53_AXI {memport "M_AXI_GP"} M54_AXI {memport "M_AXI_GP"} M55_AXI {memport "M_AXI_GP"} M56_AXI {memport "M_AXI_GP"} M57_AXI {memport "M_AXI_GP"} M58_AXI {memport "M_AXI_GP"} M59_AXI {memport "M_AXI_GP"} M60_AXI {memport "M_AXI_GP"} M61_AXI {memport "M_AXI_GP"} M62_AXI {memport "M_AXI_GP"} M63_AXI {memport "M_AXI_GP"}} [get_bd_cells interconnect_axilite]

# ---- address map ----
assign_bd_address -offset 0x00000000 -range 2G -target_address_space [get_bd_addr_spaces axi_vip_0/Master_AXI] [get_bd_addr_segs zynq_ultra_ps_e_0/SAXIGP5/HP3_DDR_LOW]
assign_bd_address -offset 0x00000000 -range 2G -target_address_space [get_bd_addr_spaces axi_vip_1/Master_AXI] [get_bd_addr_segs zynq_ultra_ps_e_0/SAXIGP6/LPD_DDR_LOW]
assign_bd_address -offset 0x0080020000 -range 4K -target_address_space [get_bd_addr_spaces zynq_ultra_ps_e_0/Data] [get_bd_addr_segs axi_intc_0/S_AXI/Reg]

validate_bd_design
save_bd_design
